# Altium schematic sheet Level Sensor.SchDoc
size A
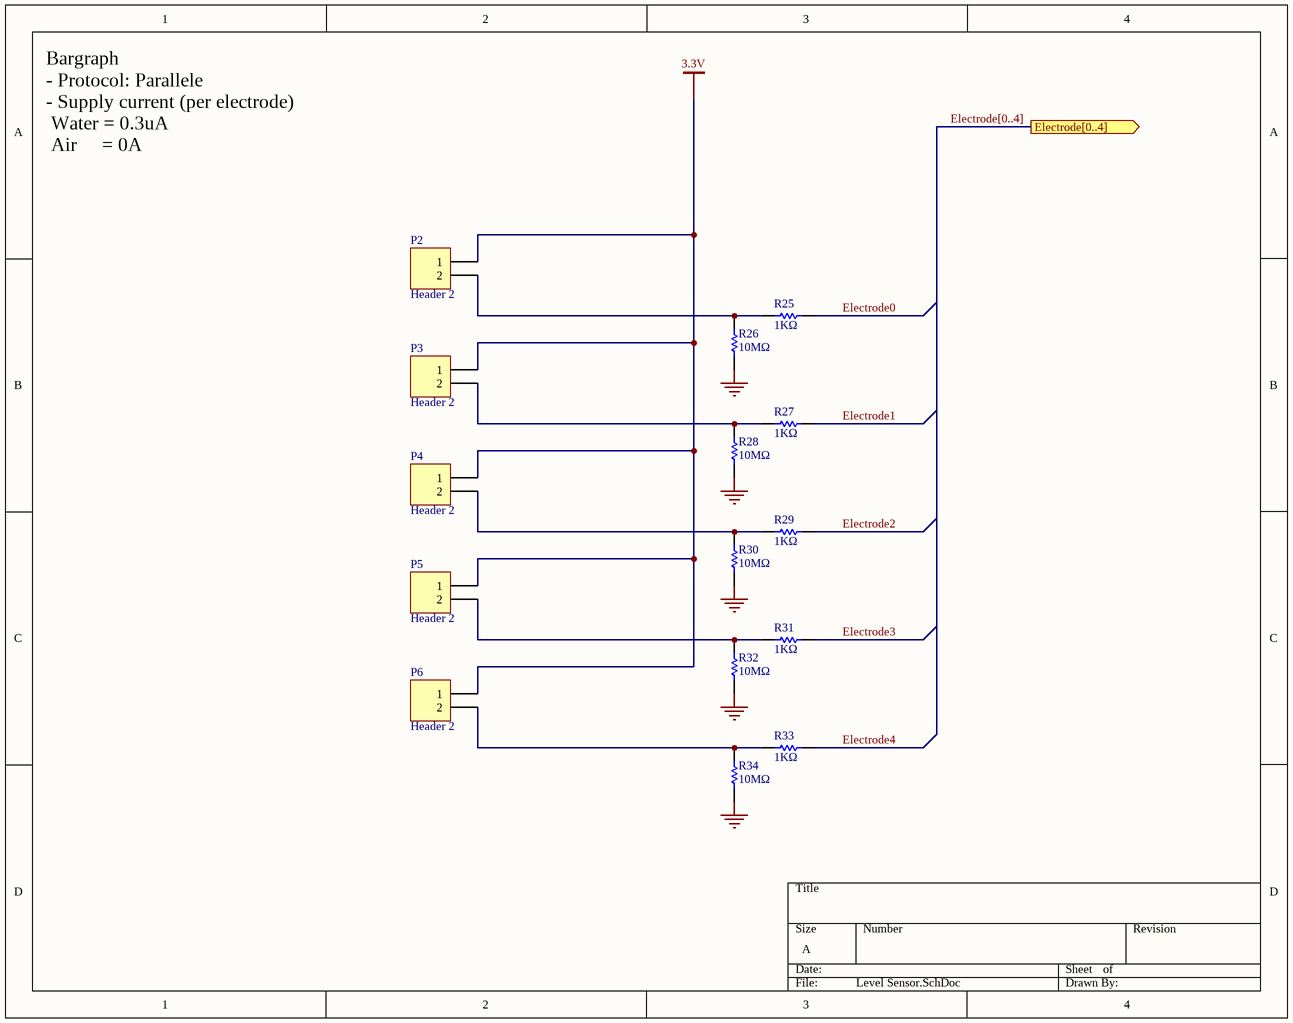
[diagram p0: Level Sensor.SchDoc]

## Parts
P2  Header 2  [BORNIER]
P3  Header 2  [BORNIER]
P4  Header 2  [BORNIER]
P5  Header 2  [BORNIER]
P6  Header 2  [BORNIER]
R25  1KΩ  [R0603]
R26  10MΩ  [R0603]
R27  1KΩ  [R0603]
R28  10MΩ  [R0603]
R29  1KΩ  [R0603]
R30  10MΩ  [R0603]
R31  1KΩ  [R0603]
R32  10MΩ  [R0603]
R33  1KΩ  [R0603]
R34  10MΩ  [R0603]

## Ports
Electrode[0..4] (out)

## Nets
3.3V: P2.1 P3.1 P4.1 P5.1 P6.1
GND: R26.1 R28.1 R30.1 R32.1 R34.1
Electrode0: R25.2
Electrode1: R27.2
Electrode2: R29.2
Electrode3: R31.2
Electrode4: R33.2
NetP2_2: P2.2 R25.1 R26.2
NetP3_2: P3.2 R27.1 R28.2
NetP4_2: P4.2 R29.1 R30.2
NetP5_2: P5.2 R31.1 R32.2
NetP6_2: P6.2 R33.1 R34.2

## Buses and harness runs
bus Electrode[0..4] = port Electrode[0..4]

## Notes on the sheet
- Bargraph
  - Protocol: Parallele
  - Supply current (per electrode)
  Water = 0.3uA
  Air     = 0A

## Library data of the parts
P2-P6 = Header 2: Header, 2-Pin; Manufacturer: BUCHANAN - TE CONNECTIVITY; Ref.Manufacturer: 282834-2; LatestRevisionDate: 17-Jul-2002; LatestRevisionNote: Re-released for DXP Platform.; Publisher: Altium Limited; Ref.Farnell: 2112482; Supplier: Farnell
R25 R27 R29 R31 R33 = Res1: Resistor; Manufacturer: MULTICOMP; Ref.Manufacturer: MC0063W060311K; Value: 1K; Published: 8-Jun-2000; LatestRevisionDate: 17-Jul-2002; LatestRevisionNote: Re-released for DXP Platform.; PackageReference: AXIAL-0.3; Publisher: Altium Limited; PackageDescription: Axial Device, Thru-Hole; 2 Leads; 0.3 in Pin Spacing; Ref.Farnell: 9330380; Supplier: Farnell
R26 R28 R30 R32 R34 = Res1: Resistor; Manufacturer: MULTICOMP; Value: 1K; Published: 8-Jun-2000; LatestRevisionDate: 17-Jul-2002; LatestRevisionNote: Re-released for DXP Platform.; PackageReference: AXIAL-0.3; Publisher: Altium Limited; PackageDescription: Axial Device, Thru-Hole; 2 Leads; 0.3 in Pin Spacing; Ref.Farnell: ?; Supplier: Farnell